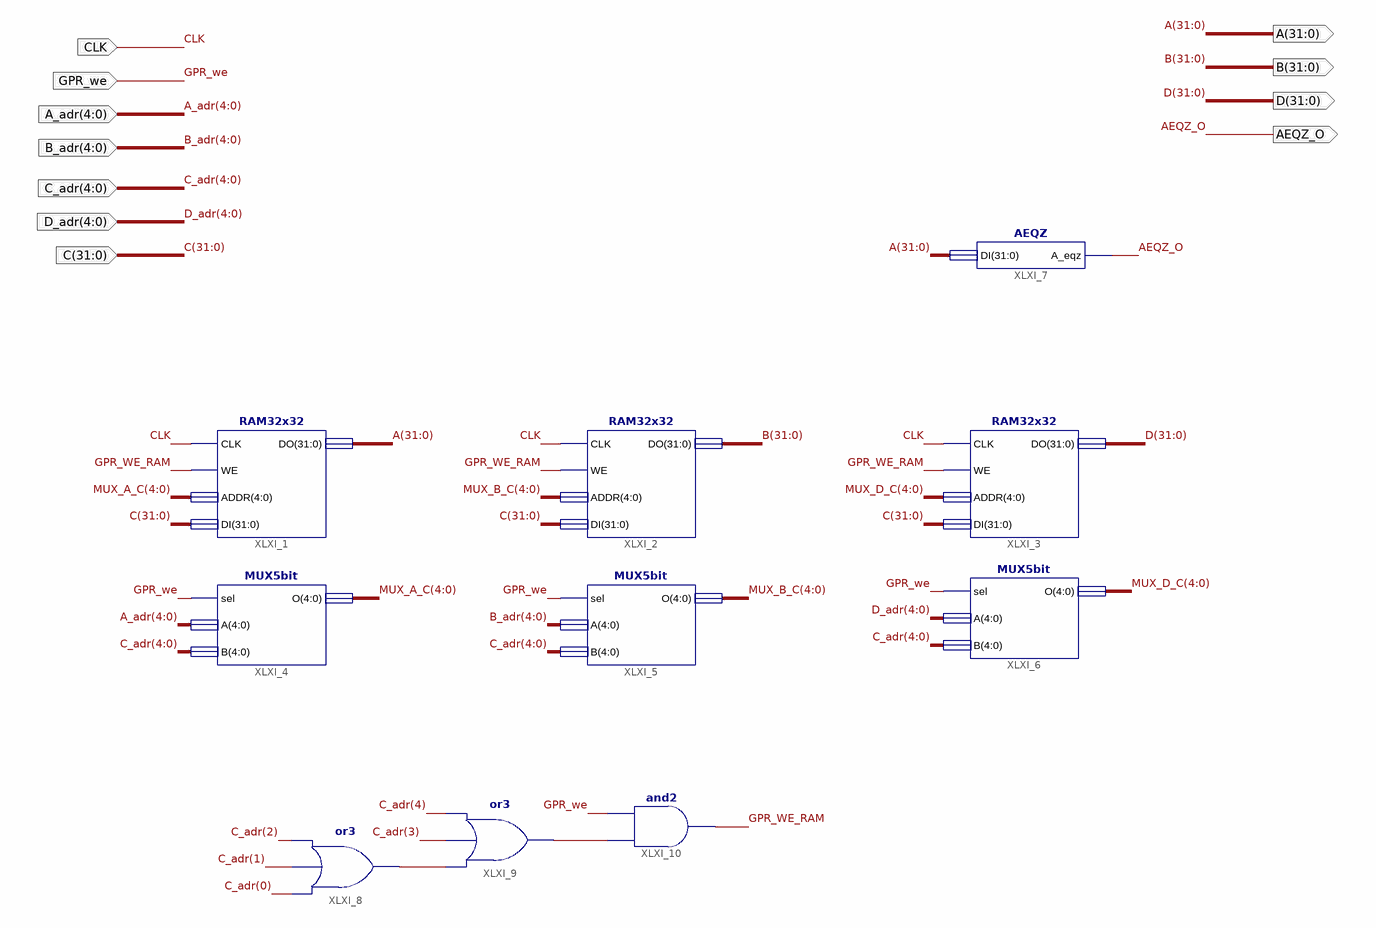
[diagram p0: schematic sheet 1]
// Xilinx ISE schematic GPR_env_sch.sch (spartan6) as structural Verilog: 10 symbols, 11 ports
module GPR_env_sch (
  input  CLK,
  input  GPR_we,
  input  [4:0] A_adr,
  input  [4:0] B_adr,
  input  [4:0] C_adr,
  input  [4:0] D_adr,
  input  [31:0] C,
  output [31:0] A,
  output [31:0] B,
  output [31:0] D,
  output AEQZ_O
);

  wire GPR_WE_RAM, XLXN_47, XLXN_48;
  wire [4:0] MUX_A_C, MUX_B_C, MUX_D_C;

  RAM32x32 XLXI_1 (.CLK(CLK), .WE(GPR_WE_RAM), .ADDR(MUX_A_C), .DI(C), .DO(A));
  RAM32x32 XLXI_2 (.CLK(CLK), .WE(GPR_WE_RAM), .ADDR(MUX_B_C), .DI(C), .DO(B));
  RAM32x32 XLXI_3 (.CLK(CLK), .WE(GPR_WE_RAM), .ADDR(MUX_D_C), .DI(C), .DO(D));
  MUX5bit XLXI_4 (.sel(GPR_we), .A(A_adr), .B(C_adr), .O(MUX_A_C));
  MUX5bit XLXI_5 (.sel(GPR_we), .A(B_adr), .B(C_adr), .O(MUX_B_C));
  MUX5bit XLXI_6 (.sel(GPR_we), .A(D_adr), .B(C_adr), .O(MUX_D_C));
  AEQZ XLXI_7 (.DI(A), .A_eqz(AEQZ_O));
  or XLXI_8 (XLXN_47, C_adr[0], C_adr[1], C_adr[2]);
  or XLXI_9 (XLXN_48, XLXN_47, C_adr[3], C_adr[4]);
  and XLXI_10 (GPR_WE_RAM, XLXN_48, GPR_we);
endmodule
